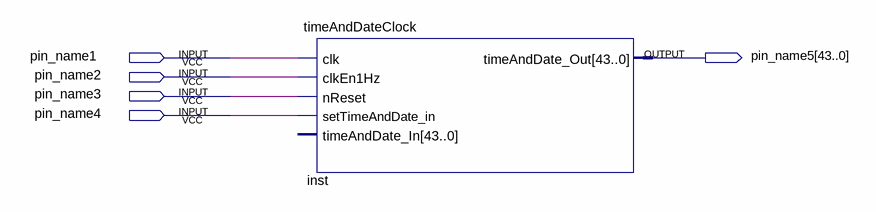
[diagram p0: schematic sheet]
// Quartus schematic Task3.bdf as structural Verilog: 1 symbols, 5 pins
module Task3 (
  input  pin_name1,
  input  pin_name2,
  input  pin_name3,
  input  pin_name4,
  output [43:0] pin_name5
);

  timeAndDateClock inst (
    .clk(pin_name1), .clkEn1Hz(pin_name2), .nReset(pin_name3), .setTimeAndDate_in(pin_name4),
    .timeAndDate_Out(pin_name5));  // open: timeAndDate_In
endmodule
